# Altium schematic sheet LED_ALERT.SchDoc
size A4; Author: Khanh BK; Organization: DB Bach Khoa HN; Address1: Bach Khoa- HBT - HN; Address2: khanh.db192932; Address3: Youtube: Đào Bá Khánh; Address4: 0357698570; Revision: 1.0Ver; SheetNumber: 7; SheetTotal: 9
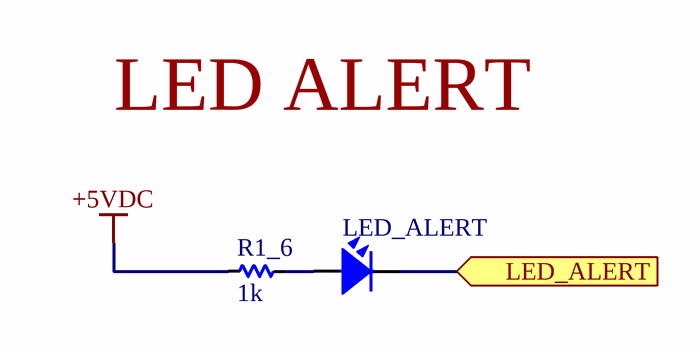
[diagram p0: LED_ALERT.SchDoc]

## Parts
LED_ALERT  LED  [LED-3MM-GREEN]  (value not drawn)
R1_6  1k  [RES-SMD-0805]

## Ports
LED_ALERT (in)

## Nets
+5VDC: R1_6.2
LED_ALERT: LED_ALERT.2 ; port LED_ALERT
NetLED_ALERT_1: LED_ALERT.1 R1_6.1

## Notes on the sheet
- LED ALERT
- Title
- Size:
- Date:
- Author:
- A4
- Time:
- Number:
- Checked:
- Revision:
- Sheet
- Approved:
- of
- File:

## Library data of the parts
LED_ALERT = LED: LED Single colour Green and Red; Value: LED 3 ly Single Colour
R1_6 = Res-SMD: Resistor; Manufacturer: Generic Components; Class: Passive; Published: 08/06/2000; Publisher: Altium Hobart Technology Centre